# Altium schematic sheet select_load.SchDoc
size 165 x 63 mm; SheetNumber: 12; SheetTotal: 14
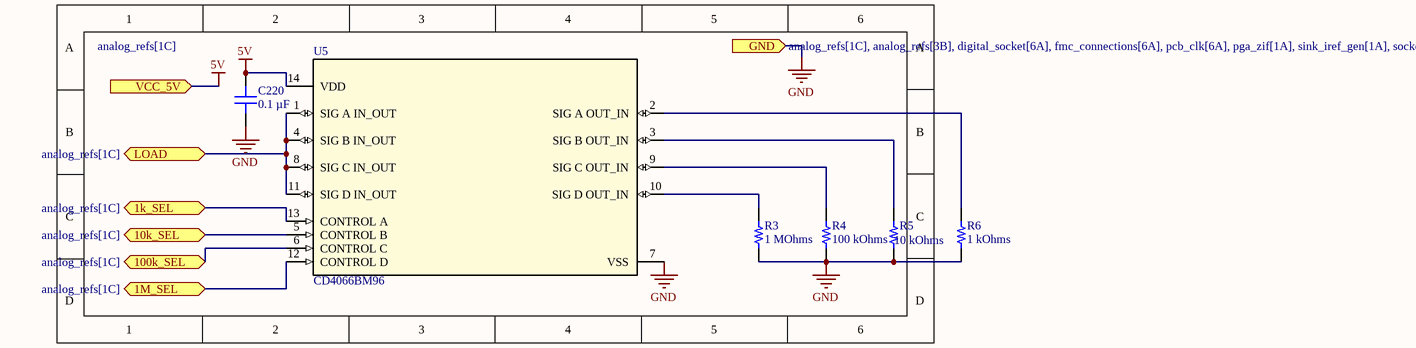
[diagram p0: select_load.SchDoc]

## Parts
C220  0.1 µF  [CAP 0805_2012]
R3  1 MOhms  [YAGEO RES 0805_2012]
R4  100 kOhms  [RES 0805_2012]
R5  10 kOhms  [RES 0805_2012]
R6  1 kOhms  [RES 0805_2012]
U5  CD4066BM96  [D0014A_N]

## Ports
1k_SEL (bidir, see analog_refs[1C]), 1M_SEL (bidir, see analog_refs[1C]), 10k_SEL (bidir, see analog_refs[1C]), 100k_SEL (bidir, see analog_refs[1C]), GND (in, see analog_refs[1C], analog_refs[3B], digital_socket[6A], fmc_connections[6A], pcb_clk[6A], pga_zif[1A], sink_iref_gen[1A], socket[3D], source_iref_gen[2B], usb_dc_converter[1C], usb_jtag[6C]), LOAD (bidir, see analog_refs[1C]), VCC_5V (in, see analog_refs[1C])

## Nets
5V: C220.2 U5.14(VDD) ; port VCC_5V
GND: C220.1 R3.1 R4.1 R5.1 R6.1 U5.7(VSS) ; port GND
1k_SEL: U5.13(CONTROL_A) ; port 1k_SEL
1M_SEL: U5.12(CONTROL_D) ; port 1M_SEL
10k_SEL: U5.5(CONTROL_B) ; port 10k_SEL
100k_SEL: U5.6(CONTROL_C) ; port 100k_SEL
LOAD: U5.1(SIG_A_IN_OUT) U5.4(SIG_B_IN_OUT) U5.8(SIG_C_IN_OUT) U5.11(SIG_D_IN_OUT) ; port LOAD
NetR3_2: R3.2 U5.10(SIG_D_OUT_IN)
NetR4_2: R4.2 U5.9(SIG_C_OUT_IN)
NetR5_2: R5.2 U5.3(SIG_B_OUT_IN)
NetR6_2: R6.2 U5.2(SIG_A_OUT_IN)

## Library data of the parts
C220 = 160R15W104KV4T: CAP CER 0.1UF 16V X7R 0805; manufacturer: Johanson Dielectrics Inc.; Tolerance: ±10%; Part Number: 160R15W104KV4T; Capacitance: 0.1 µF; Applications: General Purpose; componentlink1description: Datasheet; componentlink1url: https://www.johansondielectrics.com/downloads/catalog/johanson-dielectrics-product-catalog.pdf; componentlink2description: DigiKey Link; componentlink2url: https://www.digikey.com/en/products/detail/johanson-dielectrics-inc/160R15W104KV4T/1859428; Device Package: 0805 (2012 Metric); lastupdated: 4/6/2026 7:32:57 PM; Lifecycle Status: Active; Minimum Order: 1; Mounting Type: Surface Mount, MLCC; Operating Temperature: -55°C ~ 125°C; Package / Case: 0805 (2012 Metric); packaging: TapeAndReel; partid: 9125; Part Status: Active; price: 0.03; series: -; Size / Dimension: 0.080" L x 0.050" W (2.03mm x 1.27mm); Supplier 1: DigiKey; Supplier Part Number 1: 709-1183-1-ND; Temperature Coefficient: X7R; Thickness (Max): 0.050" (1.27mm); value: 0.1 µF; Voltage - Rated: 16V
R3 = AC0805FR-7W1ML: RES 1 MOHM 1% 1/4W 0805; Manufacturer: Yageo; Power (Watts): 0.25W, 1/4W; Temperature Coefficient: ±100ppm/°C; Part Number: AC0805FR-7W1ML; Value: 1 MOhms; ComponentLink1Description: Datasheet; ComponentLink1URL: https://www.yageo.com/upload/media/product/productsearch/datasheet/rchip/PYu-AC_51_RoHS_L_9.pdf; ComponentLink2Description: DigiKey Link; ComponentLink2URL: https://www.digikey.com/en/products/detail/yageo/AC0805FR-7W1ML/16982127; Composition: Thick Film; Device Package: 0805 (2012 Metric); Features: Automotive AEC-Q200, Moisture Resistant; Height - Seated (Max): 0.024" (0.60mm); LastUpdated: 4/5/2026 9:17:50 PM; Lifecycle Status: Active; Minimum Order: 1; Number of Terminations: 2; Operating Temperature: -55°C ~ 155°C; Package / Case: 0805 (2012 Metric); Packaging: TapeAndReel; PartId: 76421; Part Status: Active; Price: 0.01; Ratings: AEC-Q200; Resistance: 1 MOhms; Series: AC; Size / Dimension: 0.079" L x 0.049" W (2.00mm x 1.25mm); Supplier 1: DigiKey; Supplier Part Number 1: 13-AC0805FR-7W1MLCT-ND; Supplier Device Package: 0805; Tolerance: ±1%
R4 = 3430A2F100KTDF: 3430 A2 1% 100K 100PPM 1K RL; Manufacturer: TE Connectivity Passive Product; Power (Watts): 1W; Temperature Coefficient: ±100ppm/°C; Part Number: 3430A2F100KTDF; Value: 100 kOhms; ComponentLink1Description: Datasheet; ComponentLink1URL: https://www.te.com/usa-en/product-4-2176559-1.datasheet.pdf; ComponentLink2Description: DigiKey Link; ComponentLink2URL: https://www.digikey.com/en/products/detail/te-connectivity-passive-product/3430A2F100KTDF/17763668; Composition: Thick Film; Device Package: 0805 (2012 Metric); Features: Automotive AEC-Q200; Height - Seated (Max): 0.026" (0.65mm); LastUpdated: 4/5/2026 8:08:27 PM; Lifecycle Status: Active; Minimum Order: 1; Number of Terminations: 2; Operating Temperature: -55°C ~ 155°C; Package / Case: 0805 (2012 Metric); Packaging: TapeAndReel; PartId: 78438; Part Status: Active; Price: 0.02; Ratings: AEC-Q200; Resistance: 100 kOhms; Series: 3430; Size / Dimension: 0.049" L x 0.079" W (1.25mm x 2.00mm); Supplier 1: DigiKey; Supplier Part Number 1: 1712-3430A2F100KTDFCT-ND; Supplier Device Package: 0508; Tolerance: ±1%
R5 = 3430A2F10KTDF: 3430 A2 1% 10K 100PPM 1K RL; Manufacturer: TE Connectivity Passive Product; Power (Watts): 1W; Temperature Coefficient: ±100ppm/°C; Part Number: 3430A2F10KTDF; Value: 10 kOhms; ComponentLink2Description: DigiKey Link; ComponentLink2URL: https://www.digikey.com/en/products/detail/te-connectivity-passive-product/3430A2F10KTDF/17764190; Composition: Thick Film; Device Package: 0805 (2012 Metric); Features: Automotive AEC-Q200; Height - Seated (Max): 0.026" (0.65mm); LastUpdated: 4/5/2026 8:08:30 PM; Lifecycle Status: Active; Minimum Order: 1; Number of Terminations: 2; Operating Temperature: -55°C ~ 155°C; Package / Case: 0805 (2012 Metric); Packaging: TapeAndReel; PartId: 77781; Part Status: Active; Price: 0.02; Ratings: AEC-Q200; Resistance: 10 kOhms; Series: 3430; Size / Dimension: 0.049" L x 0.079" W (1.25mm x 2.00mm); Supplier 1: DigiKey; Supplier Part Number 1: 1712-3430A2F10KTDFCT-ND; Supplier Device Package: 0508; Tolerance: ±1%
R6 = CHP0805AFX-1001ELF: RESHIGHPOWERA 0805 1K 1% 1/2W TC; Manufacturer: Bourns Inc.; Power (Watts): 0.5W, 1/2W; Temperature Coefficient: ±100ppm/°C; Part Number: CHP0805AFX-1001ELF; Value: 1 kOhms; ComponentLink1Description: Datasheet; ComponentLink1URL: https://www.bourns.com/docs/product-datasheets/chp-a.pdf; ComponentLink2Description: DigiKey Link; ComponentLink2URL: https://www.digikey.com/en/products/detail/bourns-inc/CHP0805AFX-1001ELF/12144379; Composition: Thick Film; Device Package: 0805 (2012 Metric); Features: Anti-Sulfur, Automotive AEC-Q200, Moisture Resistant, Pulse Withstanding; Height - Seated (Max): 0.024" (0.60mm); LastUpdated: 4/5/2026 8:09:01 PM; Lifecycle Status: Active; Minimum Order: 1; Number of Terminations: 2; Operating Temperature: -55°C ~ 155°C; Package / Case: 0805 (2012 Metric); Packaging: TapeAndReel; PartId: 66642; Part Status: Active; Price: 0.08; Ratings: AEC-Q200; Resistance: 1 kOhms; Series: CHP-A; Size / Dimension: 0.079" L x 0.049" W (2.00mm x 1.25mm); Supplier 1: DigiKey; Supplier Part Number 1: 118-CHP0805AFX-1001ELFCT-ND; Supplier Device Package: 0805; Tolerance: ±1%
U5 = CD4066BM96: 10-pA on-state leakage current, 20-V, 1:1 (SPST), 4-channel analog switch 14-SOIC -55 to 125; Manufacturer_Name: Texas Instruments; TYPE: TYPE; RefDes: RefDes; Copyright: Copyright (C) 2026 Ultra Librarian. All rights reserved.; Manufacturer_Part_Number: CD4066BM96